# EasyEDA Pro project DRV8701E双驱.eprj

# Schematic SCH-DRV8701E双驱
Create Date: 2023-09-15; Page Name: P1; Project Name: DRV8701E双驱; Schematic Name: SCH-DRV8701E双驱; Update Date: 2024-07-12; Company: 嘉立创EDA; Page Size: A4; Version: V1.0
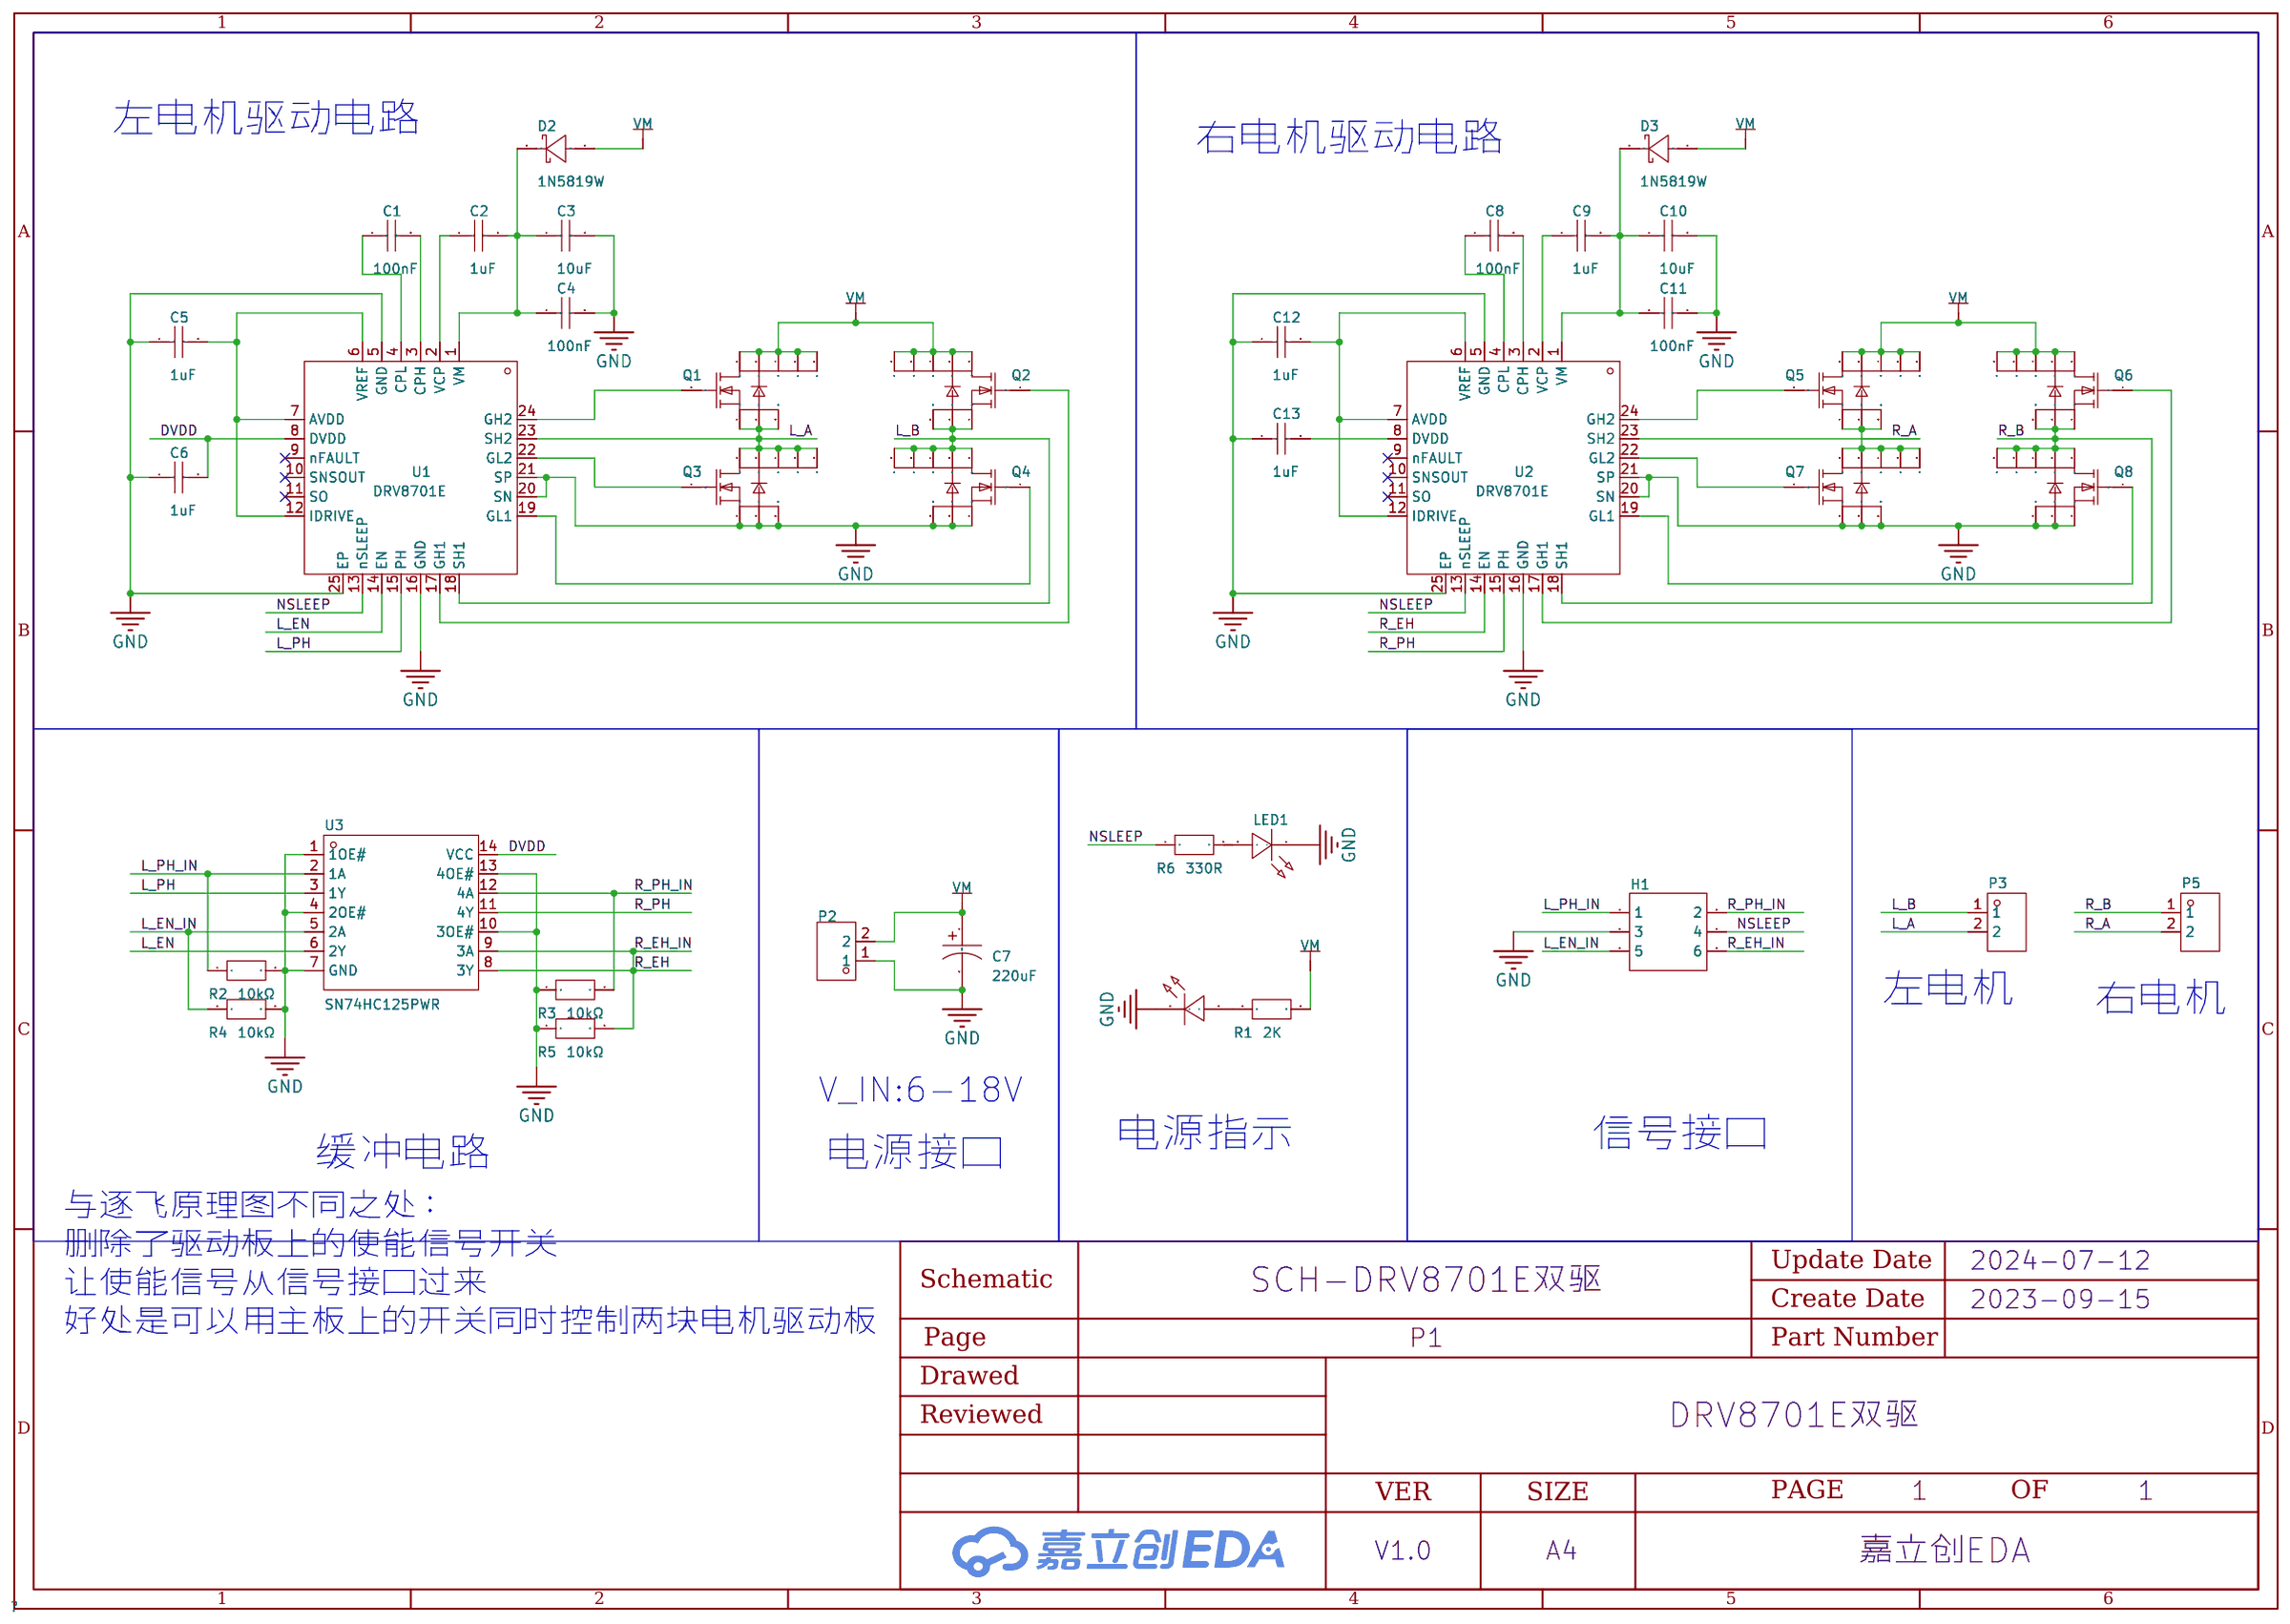
[diagram p0: schematic sheet]

## Parts
C1  100nF  [C0805]
C2  1uF  [C0805]
C3  10uF  [C0805]
C4  100nF  [C0805]
C5  1uF  [C0805]
C6  1uF  [C0805]
C7  220uF  [CAP-TH_BD8.0-P3.50-D0.6-FD]
C8  100nF  [C0805]
C9  1uF  [C0805]
C10  10uF  [C0805]
C11  100nF  [C0805]
C12  1uF  [C0805]
C13  1uF  [C0805]
D2  1N5819W  [SOD-123_L2.7-W1.6-LS3.7-R-RD]
D3  1N5819W  [SOD-123_L2.7-W1.6-LS3.7-R-RD]
H1  -  [HDR-TH_6P-P2.54-V-F-R2-C3-S2.54]
LED1  P2-0805UVTCS2-0.8T  [LED0805-RD_PURPLE]
LED2  P2-0805UVTCS2-0.8T  [LED0805-RD_PURPLE]
P2  WJ306V-5.0-2P-14-00A  [CONN-TH_2P-P5.00_L7.6-W10.0]
P3  WJ306V-5.0-2P-14-00A  [CONN-TH_2P-P5.00_L7.6-W10.0]
P5  WJ306V-5.0-2P-14-00A  [CONN-TH_2P-P5.00_L7.6-W10.0]
Q1  TPH1R403NL,L1Q(M  [DSOP-8_L5.0-W5.0-P1.27-LS6.0-BL-EP]
Q2  TPH1R403NL,L1Q(M  [DSOP-8_L5.0-W5.0-P1.27-LS6.0-BL-EP]
Q3  TPH1R403NL,L1Q(M  [DSOP-8_L5.0-W5.0-P1.27-LS6.0-BL-EP]
Q4  TPH1R403NL,L1Q(M  [DSOP-8_L5.0-W5.0-P1.27-LS6.0-BL-EP]
Q5  TPH1R403NL,L1Q(M  [DSOP-8_L5.0-W5.0-P1.27-LS6.0-BL-EP]
Q6  TPH1R403NL,L1Q(M  [DSOP-8_L5.0-W5.0-P1.27-LS6.0-BL-EP]
Q7  TPH1R403NL,L1Q(M  [DSOP-8_L5.0-W5.0-P1.27-LS6.0-BL-EP]
Q8  TPH1R403NL,L1Q(M  [DSOP-8_L5.0-W5.0-P1.27-LS6.0-BL-EP]
R1  2K  [R0805]
R2  10kΩ  [R0805]
R3  10kΩ  [R0805]
R4  10kΩ  [R0805]
R5  10kΩ  [R0805]
R6  330R  [R0805]
U1  DRV8701E  [VQFN-24_L4.0-W4.0-P0.50-BL-EP2.5]
U2  DRV8701E  [VQFN-24_L4.0-W4.0-P0.50-BL-EP2.5]
U3  SN74HC125PWR  [TSSOP-14_L5.0-W4.4-P0.65-LS6.5-BL]

## Library data of the parts
C1-C6 C8-C13 = CL21B104KBCNNNC: 容值:100nF;精度:±10%;额定电压:50V;材质(温度系数):X7R;; LCSC Part Name: 100nF ±10% 50V; Supplier Part: C1711; Manufacturer: SAMSUNG(三星); Supplier Footprint: 0805; JLCPCB Part Class: Extended Part; Datasheet: https://atta.szlcsc.com/upload/public/pdf/source/20160103/1457707693305.pdf; Supplier: LCSC; Tolerance: ±10%; Voltage Rated: 50V; Temperature Coefficient: X7R
C7 = 25PZE220M8X9: 类型:混合物;容值:220uF;精度:±20%;额定电压:25V;电容体直径:8mm;电容体长度:9mm;脚间距:-;纹波电流:2.3A@100kHz;等效串联电阻:27mΩ@100kHz;工作寿命:10000hrs@105℃;工作温度:-55℃~+105℃;; LCSC Part Name: 220uF ±20% 25V; Supplier Part: C1578758; Manufacturer: rubycon(红宝石); Supplier Footprint: 径向引线,8x9mm; JLCPCB Part Class: Extended Part; Datasheet: https://atta.szlcsc.com/upload/public/pdf/source/20210510/C1578758_E2F1F56A0A42A1F170EC582F74BCA115.pdf; Supplier: LCSC; Type: 混合物; Tolerance: ±20%; Rated Voltage: 25V; φD: 8mm; L: 9mm; Ripple Current: 2.3A@100kHz; Equivalent Series Resistance(ESR): 27mΩ@100kHz; Lifetime @ Temp: 10000hrs@105℃; Operating Temperature: -55℃~+105℃
D2 D3 = 1N5819W_C963381: 二极管配置:独立式;直流反向耐压(Vr):40V;平均整流电流(Io):350mA;正向压降(Vf):600mV@200mA;反向电流(Ir):5uA@30V;; LCSC Part Name: 40V 350mA 600mV@200mA; Supplier Part: C963381; Manufacturer: JSMSEMI(杰盛微); Supplier Footprint: SOD-123; JLCPCB Part Class: 扩展库; Datasheet: https://atta.szlcsc.com/upload/public/pdf/source/20211201/C266112E93E924DFE0C071C9A8E85281.pdf; Supplier: LCSC; Diode Configuration: 独立式; Reverse Voltage (Vr): 40V; Average Rectified Current (Io): 350mA; Forward Voltage (Vf@If): 600mV@200mA; Reverse Leakage Current (Ir): 5uA@30V
H1 = HDR-F_2.54_2x3: Supplier Part: C92272; Supplier Footprint: 插件
LED1 LED2 = P2-0805UVTCS2-0.8T: 峰值波长:410nm~420nm;发光角度:120°;正向电压:3V;正向电流:30mA;功耗:90mW;工作温度:-40℃~+85℃;抗静电能力:2kV;辐射功率:-;; LCSC Part Name: 0805紫光0.8T; Supplier Part: C2827270; Manufacturer: TUOZHAN(拓展光电); Supplier Footprint: 0805; JLCPCB Part Class: 扩展库; Datasheet: https://atta.szlcsc.com/upload/public/pdf/source/20210423/C2827270_475A43B7F06EF651B4600F80B81B4A43.pdf; Supplier: LCSC; Peak Wavelength: 410nm~420nm; Viewing Angle: 120°; Forward Voltage: 3V; Forward Current: 30mA; Power Dissipation: 90mW; Operating Temperature: -40℃~+85℃; Antistatic Ability: 2kV
P2 P3 P5 = WJ306V-5.0-2P-14-00A: LCSC Part Name: 接线端子 直插式/5.0mm 4P 绿色; Supplier Part: C3031443; Manufacturer: KANGNEX(康奈克斯电气); Supplier Footprint: P=5.0mm; JLCPCB Part Class: Extended Part; Datasheet: https://atta.szlcsc.com/upload/public/pdf/source/20220629/C58904DE4C7373837BBB74E73B3FE59B.pdf; Supplier: LCSC
Q1-Q8 = TPH1R403NL,L1Q(M: Supplier Part: C2940403; Manufacturer: TOSHIBA(东芝); Supplier Footprint: SOP-8; Datasheet: https://atta.szlcsc.com/upload/public/pdf/source/20220830/C277A7BCA37DB7348B2C95BA2E6DA6BE.pdf; Supplier: LCSC
R1-R6 = ERJP06J103V: 阻值:10kΩ;精度:±5%;功率:500mW;温度系数:±200ppm/℃;最大工作电压:600V;工作温度范围:-55℃~+155℃;; LCSC Part Name: 10kΩ ±5% 500mW; Supplier Part: C441955; Manufacturer: PANASONIC(松下); Supplier Footprint: 0805; JLCPCB Part Class: Extended Part; Supplier: LCSC; Tolerance: ±5%; Power(Watts): 500mW; Temperature Coefficient: ±200ppm/℃; Overload Voltage (Max): 600V; Operating Temperature Range: -55℃~+155℃
U1 U2 = DRV8701ERGET: 电源电压:0V~5.5V;输出电流:-;接口:并行;; Supplier Part: C132049; Manufacturer: TI(德州仪器); Supplier Footprint: VQFN-24(4x4); JLCPCB Part Class: Extended Part; Datasheet: https://atta.szlcsc.com/upload/public/pdf/source/20170925/C132049_1506321643935990409.pdf; Supplier: LCSC; Type: 有刷直流电机; Supply Voltage: 0V~5.5V; Interface: 并行; Operating Temperature: -40℃~+125℃@(Ta)
U3 = SN74HC125PWR: 类型:缓冲器，非反相;电源电压:2V~6V;输入类型:-;输出类型:三态;低电平输出电流(IOL):7.8mA;高电平输出电流(IOH):7.8mA;工作温度:-40℃~+85℃;; Supplier Part: C132994; Manufacturer: TI(德州仪器); Supplier Footprint: TSSOP-14; JLCPCB Part Class: Extended Part; Datasheet: https://atta.szlcsc.com/upload/public/pdf/source/20170930/C132994_1506736365150997346.pdf; Supplier: LCSC; Type: 缓冲器，非反相; Supply Voltage: 2V~6V; output type: 三态; Current-OutputLow: 7.8mA; Current-OutputHigh: 7.8mA; Operating temperature: -40℃~+85℃

## Nets
DVDD: C6.2 U1.8(DVDD) U3.14(VCC)
GND: C3.2 C4.2 C5.1 C6.1 C7.2 C10.2 C11.2 C12.1 C13.1 H1.3 LED1.1(-) LED2.1(-) P2.1 Q3.1(S) Q3.2(S) Q3.3(S) Q4.1(S) Q4.2(S) Q4.3(S) Q7.1(S) Q7.2(S) Q7.3(S) Q8.1(S) Q8.2(S) Q8.3(S) R2.2 R3.1 R4.2 R5.1 U1.5(GND) U1.16(GND) U1.20(SN) U1.21(SP) U1.25(EP) U2.5(GND) U2.16(GND) U2.20(SN) U2.21(SP) U2.25(EP) U3.1(1OE#) U3.4(2OE#) U3.7(GND) U3.10(3OE#) U3.13(4OE#)
L_A: P3.2 Q1.1(S) Q1.2(S) Q1.3(S) Q3.5(D) Q3.6(D) Q3.7(D) Q3.8(D) Q3.9(D) U1.23(SH2)
L_B: P3.1 Q2.1(S) Q2.2(S) Q2.3(S) Q4.5(D) Q4.6(D) Q4.7(D) Q4.8(D) Q4.9(D) U1.18(SH1)
L_EN: U1.14(EN) U3.6(2Y)
L_EN_IN: H1.5 R4.1 U3.5(2A)
L_PH: U1.15(PH) U3.3(1Y)
L_PH_IN: H1.1 R2.1 U3.2(1A)
NSLEEP: H1.4 R6.1 U1.13(nSLEEP) U2.13(nSLEEP)
R_A: P5.2 Q5.1(S) Q5.2(S) Q5.3(S) Q7.5(D) Q7.6(D) Q7.7(D) Q7.8(D) Q7.9(D) U2.23(SH2)
R_B: P5.1 Q6.1(S) Q6.2(S) Q6.3(S) Q8.5(D) Q8.6(D) Q8.7(D) Q8.8(D) Q8.9(D) U2.18(SH1)
R_EH: U2.14(EN) U3.8(3Y)
R_EH_IN: H1.6 R5.2 U3.9(3A)
R_PH: U2.15(PH) U3.11(4Y)
R_PH_IN: H1.2 R3.2 U3.12(4A)
VM: C7.1 D2.1(A) D3.1(A) P2.2 Q1.5(D) Q1.6(D) Q1.7(D) Q1.8(D) Q1.9(D) Q2.5(D) Q2.6(D) Q2.7(D) Q2.8(D) Q2.9(D) Q5.5(D) Q5.6(D) Q5.7(D) Q5.8(D) Q5.9(D) Q6.5(D) Q6.6(D) Q6.7(D) Q6.8(D) Q6.9(D) R1.2
$1N1474: C2.2 C3.1 C4.1 D2.2(C) U1.1(VM)
$1N1596: C2.1 U1.2(VCP)
$1N1619: C1.2 U1.3(CPH)
$1N1625: C1.1 U1.4(CPL)
$1N1654: C5.2 U1.6(VREF) U1.7(AVDD) U1.12(IDRIVE)
$1N3164: Q1.4(G) U1.24(GH2)
$1N3182: Q3.4(G) U1.22(GL2)
$1N4098: Q4.4(G) U1.19(GL1)
$1N4838: Q2.4(G) U1.17(GH1)
$1N10207: C13.2 U2.8(DVDD)
$1N10209: C12.2 U2.6(VREF) U2.7(AVDD) U2.12(IDRIVE)
$1N10210: C8.1 U2.4(CPL)
$1N10211: C9.2 C10.1 C11.1 D3.2(C) U2.1(VM)
$1N10212: C8.2 U2.3(CPH)
$1N10213: C9.1 U2.2(VCP)
$1N10218: Q5.4(G) U2.24(GH2)
$1N10219: Q7.4(G) U2.22(GL2)
$1N10221: Q8.4(G) U2.19(GL1)
$1N10222: Q6.4(G) U2.17(GH1)
$1N20971: LED1.2(+) R6.2
$1N38710: LED2.2(+) R1.1

Not connected (* = marked no-connect by the designer): U1 9(nFAULT)* 10(SNSOUT)* 11(SO)*; U2 9(nFAULT)* 10(SNSOUT)* 11(SO)*

## Notes on the sheet
- 左电机驱动电路
- 右电机驱动电路
- 左电机
- 右电机
- V_IN:6-18V
- 电源指示
- 信号接口
- 缓冲电路
- 电源接口
- 与逐飞原理图不同之处：
  删除了驱动板上的使能信号开关
  让使能信号从信号接口过来
  好处是可以用主板上的开关同时控制两块电机驱动板

# Board PCB-DRV8701E双驱
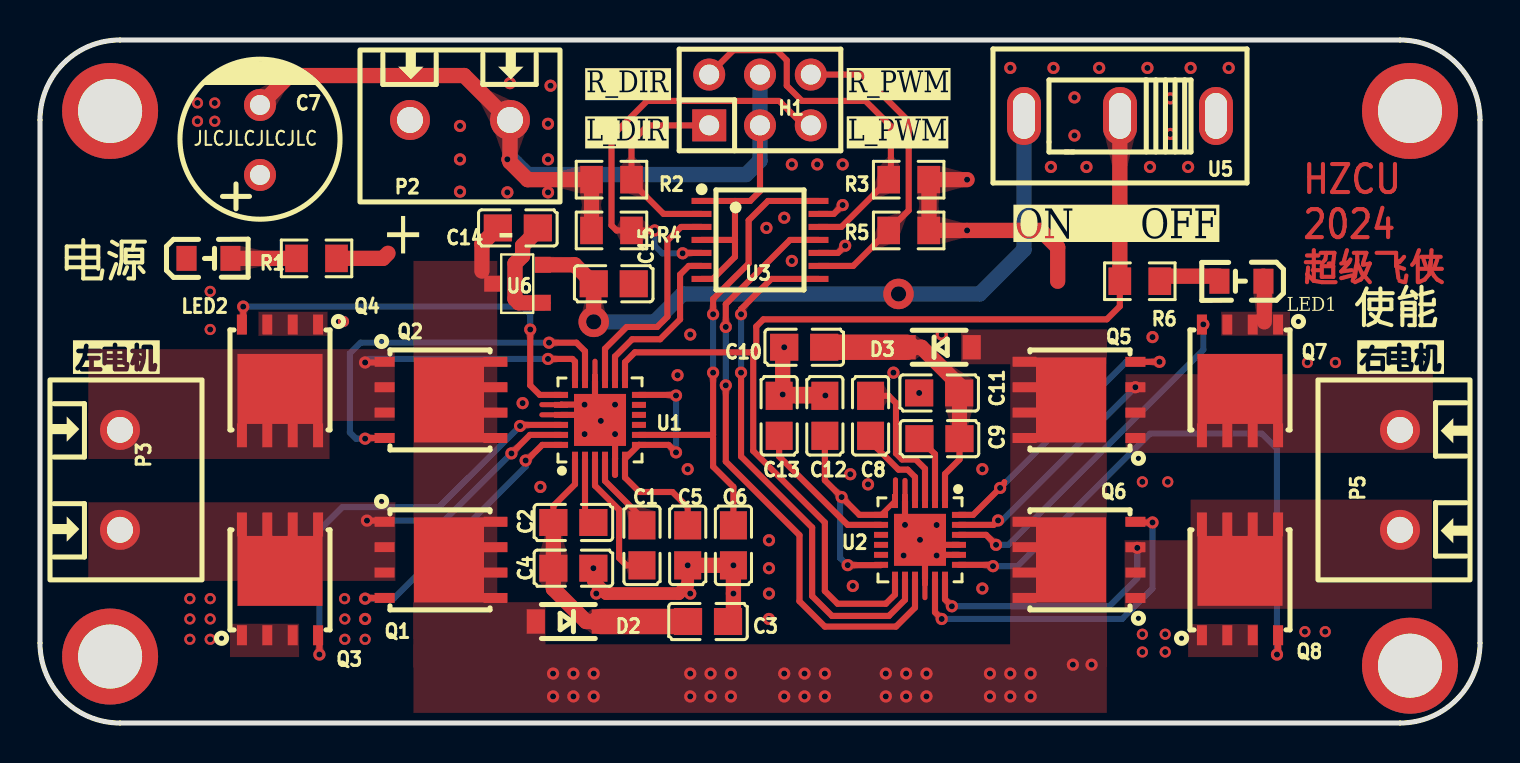
[diagram p1: board, top side]
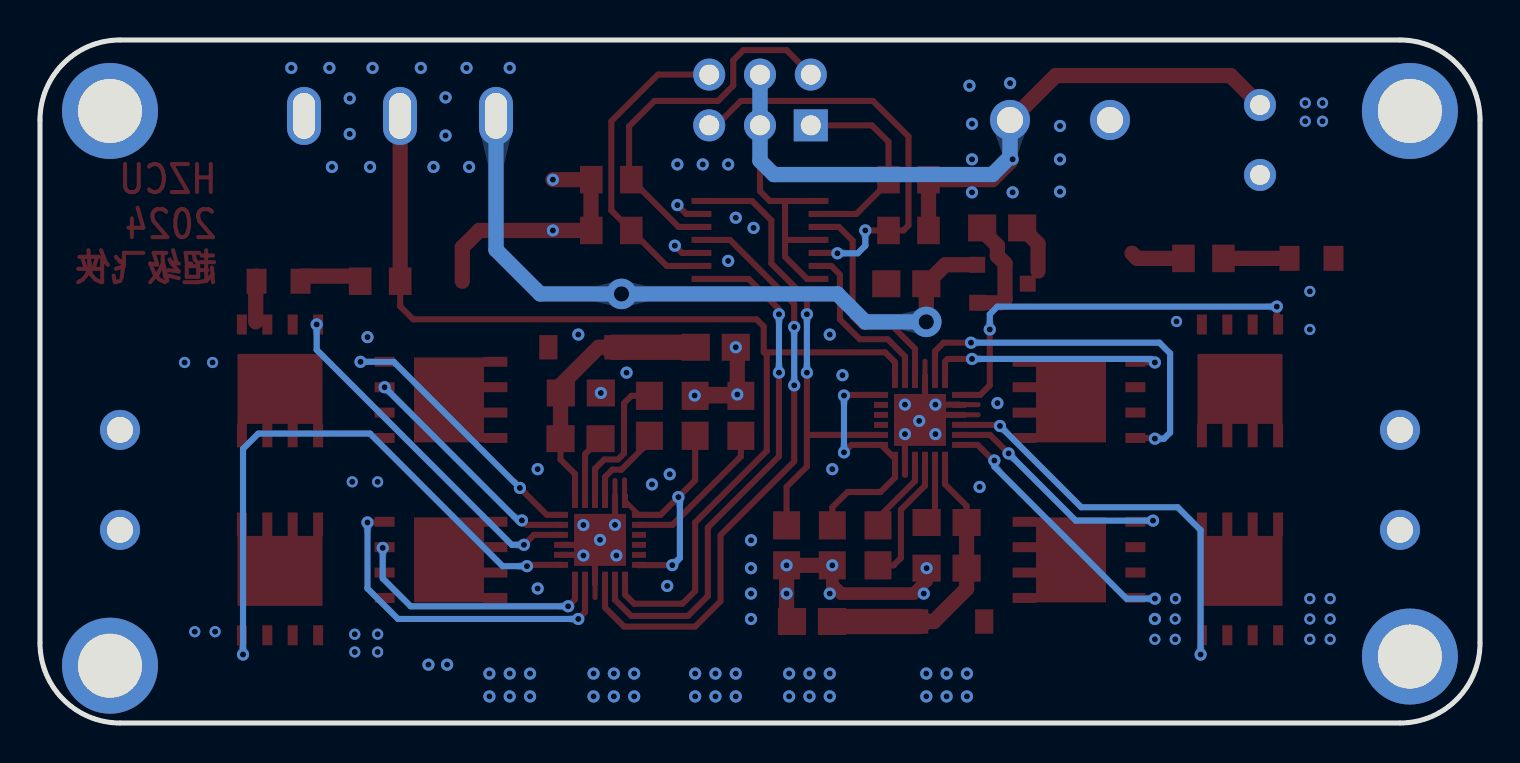
[diagram p2: board, bottom side, seen from below]

Outline 72 x 34.16 mm; copper layers: Top Layer, Bottom Layer. Coordinates in mm from the lower left corner of the outline.
Outline path: 0,30.16 0,4 arc(1.17,1.17) 4,0 68,0 arc(70.83,1.17) 72,4 72,30.16 arc(70.83,32.99) 68,34.16 4,34.16 arc(1.17,32.99) 0,30.16
Stack: Top Layer 0.035mm / Dielectric1 1.51mm FR4 er 4.5 / Bottom Layer 0.035mm

## Design rules (mm)
spacing safeClearance (default): track to track 0.152, other pairs 0.152 to 0.3
track width trackWidth (default): min 0.127, default 0.254, max 2.54
differential pair differentialPair (default): width min 0.127, default 0.254, max 2.54; gap min 0.152, default 0.152
via viaSize (default): diameter min 0.5, default 0.61, max 10; hole min 0.3, default 0.305, max 6
net GND uses copperRegion2
net VM uses copperRegion2

## Placement (name value [footprint] x y rotation side)
C1  100nF  [C0805]  30.1 8.89 270 top
C2  1uF  [C0805]  26.67 10.03 180 top
C3  10uF  [C0805]  33.4 5.08 0 top
C4  100nF  [C0805]  26.67 7.74 0 top
C5  1uF  [C0805]  32.38 8.89 90 top
C6  1uF  [C0805]  34.67 8.89 90 top
C7  220uF  [CAP-TH_BD8.0-P3.50-D0.6-FD]  11 29.16 90 top
C8  100nF  [C0805]  41.53 15.36 90 top
C9  1uF  [C0805]  44.97 14.22 0 top
C10  10uF  [C0805]  38.21 18.79 180 top
C11  100nF  [C0805]  44.96 16.51 180 top
C12  1uF  [C0805]  39.24 15.36 270 top
C13  1uF  [C0805]  36.96 15.36 270 top
C14  10uF  [C0805]  23.89 24.76 180 top
C15  10uF  [C0805]  28.69 21.97 0 top
D2  1N5819W  [SOD-123_L2.7-W1.6-LS3.7-R-RD]  26.42 5.08 180 top
D3  1N5819W  [SOD-123_L2.7-W1.6-LS3.7-R-RD]  44.96 18.79 0 top
H1  -  [HDR-TH_6P-P2.54-V-F-R2-C3-S2.54]  36 31.16 0 top
LED1  P2-0805UVTCS2-0.8T  [LED0805-RD_PURPLE]  60.07 22.09 180 top
LED2  P2-0805UVTCS2-0.8T  [LED0805-RD_PURPLE]  8.42 23.24 0 top
NOREF  -  [Pad_e21]  3.5 30.61 0 top
NOREF#2  -  [Pad_e164]  3.5 3.32 0 top
NOREF#3  -  [Pad_e166]  68.5 2.87 0 top
NOREF#4  -  [Pad_e23]  68.5 30.61 0 top
P2  WJ306V-5.0-2P-14-00A  [CONN-TH_2P-P5.00_L7.6-W10.0]  21 30.16 180 top
P3  WJ306V-5.0-2P-14-00A  [CONN-TH_2P-P5.00_L7.6-W10.0]  4 12.16 270 top
P5  WJ306V-5.0-2P-14-00A  [CONN-TH_2P-P5.00_L7.6-W10.0]  68 12.16 90 top
Q1  TPH1R403NL,L1Q(M  [DSOP-8_L5.0-W5.0-P1.27-LS6.0-BL-EP]  20 8.16 270 top
Q2  TPH1R403NL,L1Q(M  [DSOP-8_L5.0-W5.0-P1.27-LS6.0-BL-EP]  20 16.16 270 top
Q3  TPH1R403NL,L1Q(M  [DSOP-8_L5.0-W5.0-P1.27-LS6.0-BL-EP]  12 7.16 0 top
Q4  TPH1R403NL,L1Q(M  [DSOP-8_L5.0-W5.0-P1.27-LS6.0-BL-EP]  12 17.16 180 top
Q5  TPH1R403NL,L1Q(M  [DSOP-8_L5.0-W5.0-P1.27-LS6.0-BL-EP]  52 16.16 90 top
Q6  TPH1R403NL,L1Q(M  [DSOP-8_L5.0-W5.0-P1.27-LS6.0-BL-EP]  52 8.16 90 top
Q7  TPH1R403NL,L1Q(M  [DSOP-8_L5.0-W5.0-P1.27-LS6.0-BL-EP]  60 17.16 180 top
Q8  TPH1R403NL,L1Q(M  [DSOP-8_L5.0-W5.0-P1.27-LS6.0-BL-EP]  60 7.16 0 top
R1  2K  [R0805]  13.83 23.24 0 top
R2  10kΩ  [R0805]  28.57 27.17 180 top
R3  10kΩ  [R0805]  43.43 27.17 180 top
R4  10kΩ  [R0805]  28.57 24.63 180 top
R5  10kΩ  [R0805]  43.43 24.63 180 top
R6  330R  [R0805]  54.99 22.09 0 top
U1  DRV8701E  [VQFN-24_L4.0-W4.0-P0.50-BL-EP2.5]  28 15.16 0 top
U2  DRV8701E  [VQFN-24_L4.0-W4.0-P0.50-BL-EP2.5]  44 9.16 180 top
U3  SN74HC125PWR  [TSSOP-14_L5.0-W4.4-P0.65-LS6.5-BL]  36 24.16 270 top
U5  HX SS12D10G4  [SW-TH_SHOU-HAN_SS12D10G4]  54 30.36 180 top
U6  LR8341A-T33  [SOT-23-3L_L2.9-W1.6-P1.90-LS2.8-BL]  23.88 21.97 90 top

## Footprints (pads in the part's own frame, mm; a bottom-side part is the same pattern mirrored in y, then rotated)
C0805
  rect 1.41x1.35 smd: 1(-1,0) 2(1,0)
CAP-TH_BD8.0-P3.50-D0.6-FD
  round 1.6 hole 1: 1(-1.75,0) 2(1.75,0)
CONN-TH_2P-P5.00_L7.6-W10.0
  round 2 hole 1.3: 1(-2.5,0) 2(2.5,0)
DSOP-8_L5.0-W5.0-P1.27-LS6.0-BL-EP
  rect 0.5x1 smd: 1(-1.905,-2.77) 2(-0.635,-2.77) 3(0.634,-2.77) 4(1.905,-2.77)
  rect 0.5x1.2 smd: 5(1.905,2.77) 6(0.635,2.77) 7(-0.634,2.77) 8(-1.905,2.77)
  custom 4.25x3.5 smd: 9(0,0.45)
HDR-TH_6P-P2.54-V-F-R2-C3-S2.54
  rect 1.7x1.6 hole 1: 1(-2.54,-1.27)
  round 1.6 hole 1: 2(-2.54,1.27) 3(0,-1.27) 4(0,1.27) 5(2.54,-1.27) 6(2.54,1.27)
LED0805-RD_PURPLE
  rect 1.001x1.25 smd: 1(-1.1,0) 2(1.1,0)
Pad_e21
  round 4.8 hole 3.2: 1(0,0)
Pad_e23
  round 4.8 hole 3.2: 1(0,0)
Pad_e164
  round 4.8 hole 3.2: 1(0,0)
Pad_e166
  round 4.8 hole 3.2: 1(0,0)
R0805
  rect 1.133x1.377 smd: 1(-1,0) 2(1,0)
SOD-123_L2.7-W1.6-LS3.7-R-RD
  rect 0.909x1.219 smd: 1(1.625,0) 2(-1.625,0)
SOT-23-3L_L2.9-W1.6-P1.90-LS2.8-BL
  rect 0.8x0.8 smd: 1(-0.95,-1.265) 2(0.95,-1.265) 3(0.005,1.265)
SW-TH_SHOU-HAN_SS12D10G4
  oval 1.7x2.9 hole 1.1x2.3: 1(-4.8,0) 2(0,0) 3(4.8,0)
TSSOP-14_L5.0-W4.4-P0.65-LS6.5-BL
  rect 0.305x0.991 smd: 1(-1.95,-2.925) 2(-1.3,-2.925) 3(-0.65,-2.925) 4(0,-2.925) 5(0.65,-2.925) 6(1.3,-2.925) 7(1.95,-2.925) 8(1.95,2.925) 9(1.3,2.925) 10(0.65,2.925) 11(0,2.925) 12(-0.65,2.925) 13(-1.3,2.925) 14(-1.95,2.925)
VQFN-24_L4.0-W4.0-P0.50-BL-EP2.5
  rect 0.3x0.7 smd: 1(-1.25,-1.942) 2(-0.75,-1.942) 3(-0.25,-1.942) 4(0.25,-1.942) 5(0.75,-1.942) 6(1.25,-1.942) 13(1.25,1.942) 14(0.75,1.942) 15(0.25,1.942) 16(-0.25,1.942) 17(-0.75,1.942) 18(-1.25,1.942)
  rect 0.7x0.3 smd: 7(1.948,-1.25) 8(1.948,-0.75) 9(1.948,-0.25) 10(1.948,0.25) 11(1.948,0.75) 12(1.948,1.25) 19(-1.948,1.25) 20(-1.948,0.75) 21(-1.948,0.25) 22(-1.948,-0.25) 23(-1.948,-0.75) 24(-1.948,-1.25)
  rect 2.6x2.6 smd: 25(0.001,-0.001)

## Nets
As in the schematic, except:
3V3: C15.1 U5.3 U6.2
GND: C3.2 C4.2 C5.1 C6.1 C7.2 C10.2 C11.2 C12.1 C13.1 C14.1 C15.2 H1.3 H1.4 LED1.1 LED2.1 P2.1 Q3.1 Q3.2 Q3.3 Q4.1 Q4.2 Q4.3 Q7.1 Q7.2 Q7.3 Q8.1 Q8.2 Q8.3 R2.2 R3.1 R4.2 R5.1 U1.5 U1.16 U1.20 U1.21 U1.25 U2.5 U2.16 U2.20 U2.21 U2.25 U3.1 U3.4 U3.7 U3.10 U3.13 U6.1
NSLEEP: R6.1 U1.13 U2.13 U5.2
VM: C7.1 C14.2 D2.1 D3.1 P2.2 Q1.5 Q1.6 Q1.7 Q1.8 Q1.9 Q2.5 Q2.6 Q2.7 Q2.8 Q2.9 Q5.5 Q5.6 Q5.7 Q5.8 Q5.9 Q6.5 Q6.6 Q6.7 Q6.8 Q6.9 R1.2 U6.3

Pads without a net: NOREF 1; NOREF#2 1; NOREF#3 1; NOREF#4 1; U1 9 10 11; U2 9 10 11; U5 1

## Via types
v1: diameter 0.61, hole 0.305, Top Layer to Bottom Layer, 140 vias
v2: diameter 0.559, hole 0.305, Top Layer to Bottom Layer, 27 vias
v3: diameter 1.524, hole 0.762, Top Layer to Bottom Layer, 2 vias

## Routing (per net, layer and track width the routed paths; a pad name or vN(x,y) marks a point on that pad's centre or on a via; arc(x,y) is an arc through that point)
3V3: length 34.5
  Top Layer w0.762: v3(27.69,20.06) C15.1 26.74,22.92 U6.2
  Bottom Layer w0.762: U5.3 49.2,23.67 46.99,21.46 v3(42.93,21.46) 32.13,21.46 30.73,20.06 v3(27.69,20.06)
DVDD: length 23.9
  Top Layer w0.305: C6.2 34.67,11.81 33.66,12.82 33.66,14.28 ; U3.14 36.4,26.11 35.43,25.14 35.43,22.98 33.66,21.21 v1(33.66,20.44) ; U1.8 33.66,14.41 v1(33.66,17.52)
  Bottom Layer w0.305: v1(33.66,20.44) v1(33.66,17.52)
GND: length 121.3
  Top Layer w0.254: 44.25,6.27 44.25,7.21 U2.16 ; 27.75,18.09 U1.16 ; 25.09,15.92 26.04,15.92 U1.20 ; 25.09,15.41 26.05,15.41 U1.21 ; U2.5 43.25,12.13
  Top Layer w0.305: 27.75,15.41 27.25,15.91 ; 27.75,15.41 U1.21 ; 27.75,15.41 28.24,15.41 v1(28.75,15.92) ; 27.75,15.41 27.75,15.91 ; v1(40.13,25.9) 39.69,25.46 U3.13 ; U3.1 34.75,26.11 ; 34.75,26.11 35.51,26.11 36,26.6 H1.3 ; 34.75,26.11 34.75,24.19 ; 44.25,8.91 44.25,9.32 v1(44.83,9.9) 44.82,9.91 v1(43.25,9.91) U2.5 ; 44.25,8.91 U2.21 ; 44.25,8.91 44.25,8.83 ; v1(28.75,14.45) 28.75,13.22 U1.5 28.75,12.42 28.75,12.42 ; 34.75,24.19 34.75,23.32 33.64,22.21 U3.7 ; 34.75,24.19 34.72,24.16 U3.4 ; 27.75,15.91 27.74,15.92 v1(27.23,15.92) 26.06,15.92 U1.20 ; 27.75,15.91 U1.16 ; 44.25,8.83 44.38,8.83 v1(44.83,8.38) 44.86,8.41 U2.20 ; 44.25,8.83 U2.16 ; v1(40.26,23.87) 39.9,23.51 U3.10
  Top Layer w0.635: v1(32.38,7.89) 32.38,6.92 31.94,6.47 28.31,6.47 27.67,7.11 v1(27.67,7.74)
  Top Layer w0.762: C14.1 24.89,24.63 24.13,23.87 24.13,23.36 23.75,22.98 23.75,21.21 23.94,21.02 U6.1 ; 50.88,22.09 50.88,23.79 50.04,24.63 v1(46.35,24.63) 44.45,24.63 ; C3.2 34.67,5.35 v1(34.67,6.47) v1(34.67,7.89) v1(32.38,7.89) ; v1(46.35,27.17) 44.51,27.17 44.45,27.12 44.45,24.63 ; C7.2 12.47,32.38 21.21,32.38 23.43,30.16 P2.1 23.5,28.06 24.38,27.17 R2.2 R4.2 ; 44.45,24.63 R5.1 ; 61.17,22.35 61.21,22.31 61.21,20.06 ; v1(37.13,16.43) 39.18,16.43 C12.1 C13.1 37.02,16.43 v1(37.13,16.43) ; v1(37.13,16.43) 37.13,18.72 v1(37.21,18.79)
  Bottom Layer w0.762: P2.1 23.5,28.31 24.38,27.43 35.31,27.43 36,28.12 H1.3 H1.4
  vias: v1(16.26,5.2) v1(21,29.86) v1(21,28.19) v1(21,26.57) v1(23.37,28.19) v1(23.37,26.54) v1(23.5,32) v1(24.13,16) v1(25.02,11.81) v1(25.4,29.97) v1(25.4,28.19) v1(25.4,26.54) v1(25.53,31.87) v1(27.23,14.45) v1(27.81,6.47) v1(28.04,15.11) v1(31.88,17.4) v1(32.38,12.7) v1(32.51,19.43) v1(32.51,6.47) v1(36.32,24.76) v1(36.45,9.14) v1(36.45,7.74) v1(36.45,6.47) v1(36.45,5.2) v1(37.21,25.27) v1(37.59,27.94) v1(37.59,23.11) v1(38.86,27.94) v1(39.27,16.38) v1(40.13,27.94) v1(40.51,12.44) v1(40.64,6.85) v1(41.4,11.93) v1(42.67,17.52) v1(43.18,8.38) v1(43.96,16.51) v1(44,9.16) v1(45.09,19.43) v1(47.12,12.7) v1(47.12,6.73) v1(48.51,32.76) v1(50.55,27.81) v1(50.67,32.76) v1(51.72,31.29) v1(51.72,29.38) v1(52.32,27.81) v1(52.96,32.76) v1(55.37,32.76) v1(55.5,27.81) v1(55.63,19.3) v1(56.51,31.24) v1(56.51,29.46) v1(57.4,27.81) v1(57.53,32.76) v1(59.44,32.76) v2(7.49,6.22) v2(7.49,5.2) v2(7.49,4.19) v2(7.87,31.01) v2(7.87,30.1) v2(8.51,21.59) v2(8.51,19.68) v2(8.51,6.22) v2(8.51,5.2) v2(8.51,4.19) v2(8.74,31.01) v2(8.74,30.1) v2(15.17,20.08) v2(15.23,6.22) v2(15.24,5.2) v2(15.24,4.19) v2(16.26,4.19) v2(55.12,12.06) v2(55.12,4.44) v2(55.12,3.55) v2(56.26,4.44) v2(56.26,3.55) v2(56.39,12.06) v2(63.25,4.57) v2(63.37,18.03) v2(64.26,4.57) v2(64.77,18.03)
L_A: length 12.4
  Top Layer w0.305: U1.23 24.5,14.41 v1(23.57,13.48) ; v1(16.35,10.12) 17.17,10.12 Q1.1
  Bottom Layer w0.305: v1(16.35,10.12) 20.21,10.12 v1(23.57,13.48)
L_B: length 12.6
  Top Layer w0.305: Q2.1 17.2,18.03 v1(16.26,18.03) ; U1.18 26.75,18.08 26.62,18.21 v1(25.4,18.21)
  Bottom Layer w0.305: v1(16.26,18.03) 16.43,18.21 v1(25.4,18.21)
L_EN: length 8.7
  Top Layer w0.305: U1.14 28.75,18.33 29.61,19.19 31.01,19.19 32,20.19 32,22.43 32.44,22.86 U3.6
L_EN_IN: length 21.2
  Top Layer w0.305: H1.5 38.18,29.89 36.96,31.11 30.35,31.11 28.57,29.33 28.57,24.89 28.83,24.63 R4.1 v1(30.73,24.63) ; U3.5 32.15,23.51 v1(32.13,23.49)
  Bottom Layer w0.305: v1(30.73,24.63) 30.73,23.87 31.12,23.49 v1(32.13,23.49)
L_PH: length 11.2
  Top Layer w0.305: U3.3 32.05,24.81 31.37,24.13 31.37,20.32 30.86,19.81 29.34,19.81 28.25,18.72 U1.15
L_PH_IN: length 10.4
  Top Layer w0.305: H1.1 30.4,29.89 29.57,29.06 R2.1 29.57,27.06 31.18,25.46 U3.2
NSLEEP: length 55.3
  Top Layer w0.305: U1.13 29.25,18.04 29.74,18.54 35.79,18.54 ; 35.79,18.54 35.66,18.41 35.66,13.61 39.24,10.03 39.24,6.6 39.88,5.97 42.29,5.97 42.75,6.42 U2.13 ; 35.79,18.54 35.81,18.56 35.81,19.83 36.17,20.19 53.34,20.19 53.99,20.84 53.99,22.35
  Top Layer w0.762: 53.99,22.35 53.99,30.35 U5.2
R_A: length 11.7
  Top Layer w0.305: U2.23 47.68,9.91 v1(47.9,10.13)
  Bottom Layer w0.305: v1(54.77,16.79) 48.11,10.13 v1(47.9,10.13)
R_B: length 12.9
  Top Layer w0.305: v1(45.59,5.84) 45.25,6.18 U2.18
  Bottom Layer w0.305: v1(45.59,5.84) 53.47,5.84 54.86,7.23 v1(54.86,8.76)
R_EH: length 26.8
  Top Layer w0.305: v1(35.05,17.52) 35.05,13.33 38.61,9.78 38.61,6.35 39.6,5.36 42.44,5.36 43.25,6.16 U2.14 ; U3.8 36.56,22.21 35.05,20.7 v1(35.05,20.44)
  Bottom Layer w0.305: v1(35.05,17.52) v1(35.05,20.44)
R_EH_IN: length 16
  Top Layer w0.305: U3.9 40.66,22.86 R5.2 43.43,25.63 43.43,30.1 41.1,32.43 H1.6
R_PH: length 30.5
  Top Layer w0.305: U2.15 43.75,5.77 42.8,4.82 39.24,4.82 37.97,6.09 37.97,9.39 34.29,13.08 v1(34.29,16.89) ; U3.11 37.5,24.16 34.29,20.95 v1(34.29,19.81)
  Bottom Layer w0.305: v1(34.29,16.89) v1(34.29,19.81)
R_PH_IN: length 19.1
  Top Layer w0.305: U3.12 40.07,24.81 42.54,27.29 42.54,29.84 41.28,31.11 38.1,31.11 37.34,31.87 37.34,33.14 36.83,33.65 34.67,33.65 33.46,32.44 H1.2
VM: length 5.2
  Top Layer w0.762: 17.4,23.49 17.14,23.24 R1.2 ; C14.2 22.1,23.97 22.1,22.6
  vias: v1(25.65,2.47) v1(25.65,1.33) v1(26.67,2.47) v1(26.67,1.33) v1(27.69,2.47) v1(27.69,1.33) v1(32.51,2.47) v1(32.51,1.33) v1(33.53,2.47) v1(33.53,1.33) v1(34.54,2.47) v1(34.54,1.33) v1(37.21,2.47) v1(37.21,1.33) v1(38.23,2.47) v1(38.23,1.33) v1(39.24,2.47) v1(39.24,1.33) v1(42.29,2.47) v1(42.29,1.33) v1(43.31,2.47) v1(43.31,1.33) v1(44.32,2.47) v1(44.32,1.33) v1(47.5,2.47) v1(47.5,1.33) v1(48.51,2.47) v1(48.51,1.33) v1(49.53,2.47) v1(49.53,1.33) v1(51.64,2.92) v1(52.58,2.92)
$1N1474: length 14.4
  Top Layer w0.305: C2.2 25.67,10.86 26.75,11.94 U1.1
  Top Layer w0.762: C2.2 C4.1 25.67,6.71 27.31,5.08 D2.2
  Top Layer w1.27: D2.2 C3.1
$1N1596: length 3.4
  Top Layer w0.305: U1.2 27.25,10.45 C2.1
$1N1619: length 6.6
  Top Layer w0.305: 29.97,7.89 29.32,7.89 28.96,8.25 28.96,10.66 27.75,11.87 U1.3
$1N1625: length 4
  Top Layer w0.305: 29.97,9.89 29.97,10.38 28.25,12.11 U1.4
$1N1654: length 13.3
  Top Layer w0.305: 29.25,13.22 29.94,13.91 U1.7 31.43,13.91 v1(31.8,13.53) ; v1(31.8,16.38) 31.77,16.41 U1.12 ; U1.6 29.25,12.28 29.97,11.55 31.62,11.55 32.38,10.79 C5.2
  Bottom Layer w0.305: v1(31.8,13.53) v1(31.8,16.38)
$1N3164: length 14.1
  Top Layer w0.305: v1(16.26,6.22) 16.29,6.25 Q1.4 ; v1(24.28,13.13) 24.33,13.13 25.11,13.91 U1.24
  Bottom Layer w0.305: v1(16.26,6.22) 17.68,6.22 24.28,12.82 v1(24.28,13.13)
$1N3182: length 21.5
  Top Layer w0.305: v1(24,14.86) 24.06,14.91 U1.22 ; v1(13.97,3.43) 13.97,4.32 Q3.4
  Bottom Layer w0.305: v1(24,14.86) 19.94,10.79 15.11,10.79 13.97,9.65 v1(13.97,3.43)
$1N4098: length 20.7
  Top Layer w0.305: Q4.4 10.16,19.99 v1(10.16,20.82) ; U1.19 24.99,16.41 24.51,16.89 v1(24.51,19.68)
  Bottom Layer w0.305: v1(24.51,19.68) 24.51,20.44 24.13,20.82 v1(10.16,20.82)
$1N4838: length 19.6
  Top Layer w0.305: Q2.4 16.16,14.25 ; U1.17 27.25,18.59 26.82,19.02 v1(25.45,19.02)
  Bottom Layer w0.305: v1(25.45,19.02) 16.03,19.02 15.49,18.49 15.49,14.53 15.8,14.22 v1(16.26,14.22)
$1N10207: length 7.5
  Top Layer w0.305: C13.2 36.96,13.33 40.38,9.91 U2.8
$1N10209: length 13.1
  Top Layer w0.254: U2.7 42.74,11.1 U2.6 42.77,11.12 42.77,12.16
  Top Layer w0.305: 40.41,7.87 v1(40.39,7.9) 42.04,7.9 U2.12 ; C12.2 39.24,12.14 v1(40.08,11.3) 40.97,10.41 U2.7
  Bottom Layer w0.305: v1(40.39,7.9) 40.36,7.9 40,8.25 40,11.22 v1(40.08,11.3)
$1N10210: length 4.4
  Top Layer w0.305: U2.4 43.75,12.3 43.38,12.67 42.93,12.67 41.86,13.74 41.86,14.03 C8.1
$1N10211: length 13.6
  Top Layer w0.305: C9.2 45.97,13.18 45.25,12.45 U2.1
  Top Layer w0.762: C9.2 45.97,16.49 C11.1 45.96,16.9 44.07,18.79 D3.2
  Top Layer w1.27: C10.1 D3.2
$1N10212: length 7.3
  Top Layer w0.305: U2.3 44.25,12.72 43.79,13.18 43.1,13.18 42.8,13.48 42.8,16 42.43,16.36 C8.2
$1N10213: length 3.4
  Top Layer w0.305: U2.2 44.75,13.44 C9.1
$1N10218: length 14.9
  Top Layer w0.254: 48.23,12.06 48.21,12.06 48.21,11.96 v1(48.01,11.76)
  Top Layer w0.305: 56.01,18.03 v1(55.97,18.06) Q5.4 ; U2.24 46.66,10.41 v1(48.01,11.76)
  Bottom Layer w0.305: v1(48.01,11.76) 54.31,18.06 v1(55.97,18.06)
$1N10219: length 17.8
  Top Layer w0.305: v1(47.8,8.91) 47.31,9.41 U2.22 ; v1(58.17,19.94) 58.16,19.93 Q7.4
  Bottom Layer w0.305: v1(47.8,8.91) 48.41,8.91 58.17,18.67 v1(58.17,19.94)
$1N10221: length 30.3
  Top Layer w0.305: U2.19 47.59,7.91 v1(47.65,7.84) ; v1(61.85,3.43) 61.9,3.48 Q8.4
  Bottom Layer w0.305: v1(61.85,3.43) 61.85,13.71 61.09,14.47 55.5,14.47 48.87,7.84 v1(47.65,7.84)
$1N10222: length 17.5
  Top Layer w0.305: Q6.4 54.8,10.03 v1(55.63,10.03) ; v1(45.09,5.2) 44.75,5.54 U2.17
  Bottom Layer w0.305: v1(55.63,10.03) 55.63,6.73 54.1,5.2 v1(45.09,5.2)
$1N20971: length 3
  Top Layer w0.762: 55.99,22.35 58.97,22.35
$1N38710: length 3.3
  Top Layer w0.762: R1.1 LED2.2

## Copper pours and planes (outline as drawn; the poured copper is in the pictures)
GND on Top Layer: 59.06,20.57 62.5,20.57 62.5,19.37 59.06,19.37
GND on Top Layer: 10.92,20.57 14.37,20.57 14.37,19.36 10.92,19.36
GND on Top Layer: 9.5,4.96 12.95,4.96 12.95,3.3 9.5,3.3
GND on Top Layer: -15.49,35.73 88.65,35.73 89.41,34.97 89.41,0.38 86.31,-2.72 -14.83,-2.72 -15.29,-3.18 -15.29,35.53
GND on Top Layer: 57.4,4.95 60.9,4.95 60.9,3.3 57.4,3.3
GND on Bottom Layer: 83.92,44.17 -5.74,44.17 -8.08,41.83 -8.08,-10.49 -5.28,-13.29 75.84,-13.29 76.71,-12.42 76.71,36.95
L_A on Top Layer: 2.41,11.04 17.77,11.04 17.77,7.11 2.41,7.11
L_B on Top Layer: 2.41,15.49 14.48,15.49 14.48,13.2 2.41,13.2
L_B on Top Layer: 2.41,18.7 17.73,18.7 17.73,15.11 2.41,15.11
R_A on Top Layer: 54.28,17.45 69.65,17.45 69.65,13.51 54.28,13.51
R_B on Top Layer: 54.23,9.14 69.6,9.14 69.6,5.71 54.23,5.71
R_B on Top Layer: 57.53,11.17 69.6,11.17 69.6,8.51 57.53,8.51
VM on Top Layer: 22.99,5.97 25.23,5.97 25.23,4.21 22.99,4.21
VM on Top Layer: 48.52,5.2 53.34,5.2 53.34,2.79 48.52,2.79
VM on Top Layer: 18.67,23.11 22.86,23.11 22.86,4.21 18.67,4.21
VM on Top Layer: 48.51,19.68 53.34,19.68 53.34,2.79 48.51,2.79
VM on Top Layer: 18.66,6.04 25.27,6.04 25.27,2.79 18.66,2.79
VM on Top Layer: 17.14,31.37 17.14,28.44 10.03,28.44 10.03,25.52 16.64,25.52 16.64,19.94 20.19,19.94 20.19,31.37
VM on Top Layer: 46.05,19.68 53.34,19.68 53.34,17.94 46.05,17.94
VM on Top Layer: 18.67,3.93 53.34,3.93 53.34,0.5 18.67,0.5
VM on Bottom Layer: 18.67,3.81 53.09,3.81 53.28,4 53.28,0.57 53.34,0.5 18.67,0.5

Small or netless copper shapes (teardrops, artwork), in the pictures only: 98 on Top Layer, 39 on Bottom Layer

## Text on the board
Top Layer: HZCU / 2024 / 超级飞侠
Top Solder Mask Layer: HZCU / 2024 / 超级飞侠
Top Silkscreen Layer: JLCJLCJLCJLC | 电源 | 使能 | 左电机 | R_DIR | L_DIR | R_PWM | L_PWM | 右电机 | ON      OFF | + | -
